# Altium project Light Control - 8-16 in 16-32 out.PrjPcb
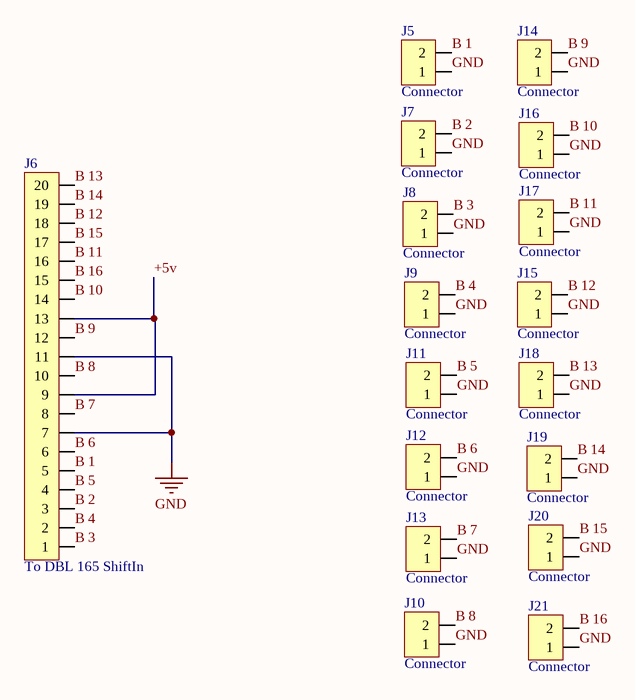
[diagram p0: Input interface for DBL165 ShiftIn Reg.SchDoc]
1 sheet, 17 parts. Net scope: global (net labels, ports and power ports of the same name join across sheets).
Board files: DBL 165 SerialIn Register.PcbDoc, Input interface for DBL165 ShiftIn Reg.PcbDoc

## Sheet Input interface for DBL165 ShiftIn Reg.SchDoc
size A4

### Parts
J5  Connector  [DG301 5mm 2p]
J6  To DBL 165 ShiftIn  [LINE 2.54 x 20D (2 x 10) - BH]
J7  Connector  [DG301 5mm 2p]
J8  Connector  [DG301 5mm 2p]
J9  Connector  [DG301 5mm 2p]
J10  Connector  [DG301 5mm 2p]
J11  Connector  [DG301 5mm 2p]
J12  Connector  [DG301 5mm 2p]
J13  Connector  [DG301 5mm 2p]
J14  Connector  [DG301 5mm 2p]
J15  Connector  [DG301 5mm 2p]
J16  Connector  [DG301 5mm 2p]
J17  Connector  [DG301 5mm 2p]
J18  Connector  [DG301 5mm 2p]
J19  Connector  [DG301 5mm 2p]
J20  Connector  [DG301 5mm 2p]
J21  Connector  [DG301 5mm 2p]

### Nets
GND: J5.1 J6.7 J6.11 J7.1 J8.1 J9.1 J10.1 J11.1 J12.1 J13.1 J14.1 J15.1 J16.1 J17.1 J18.1 J19.1 J20.1 J21.1
+5v: J6.9 J6.13
B 1: J5.2 J6.5
B 2: J6.3 J7.2
B 3: J6.1 J8.2
B 4: J6.2 J9.2
B 5: J6.4 J11.2
B 6: J6.6 J12.2
B 7: J6.8 J13.2
B 8: J6.10 J10.2
B 9: J6.12 J14.2
B 10: J6.14 J16.2
B 11: J6.16 J17.2
B 12: J6.18 J15.2
B 13: J6.20 J18.2
B 14: J6.19 J19.2
B 15: J6.17 J20.2
B 16: J6.15 J21.2

### Notes on the sheet
- Title
- Size:
- Date:
- A4
- Number:
- Time:
- Revision:
- Sheet
- of
- File:

### Library data of the parts
J5 J7-J21 = DG301-5.0-2P12: DG301 series
J6 = PLD-20 (2 x 10): Vert, Dbl line, Male